# EAGLE design Single_RGB_Board (EAGLE 9.5.1)
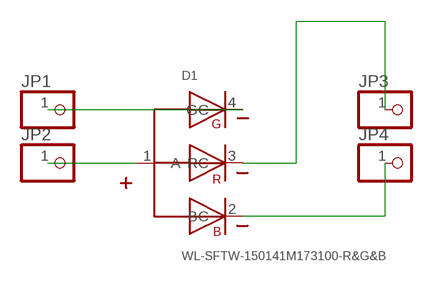
[diagram p0: schematic, sheet 1]

## Parts
D1  WL-SFTW-150141M173100-R&G&B  [3528-COMMON-ANODE]
JP1  PINHD-1X1  [1X01]
JP2  PINHD-1X1  [1X01]
JP3  PINHD-1X1  [1X01]
JP4  PINHD-1X1  [1X01]

## Nets
N$1: D1.4(GC) JP1.1
N$2: D1.1(A) JP2.1
N$3: D1.3(RC) JP3.1
N$4: D1.2(BC) JP4.1

## Library data of the parts
D1 = Wurth_Elektronik_Optoelectronics_rev15b:WL-SFTW: SMD full-color TOP LED Characteristics Low energy consumption High reliability Low current requirement Fast switching No UV/IR radiation High brightness RGB individual control Compact package outline Black surface Applications Flash light Switch indicators Equipments indicators Accent and decorative lighting Electronic signage Video displays Backlight for LCDs, PDAs and TVs Oven, microwave Street lighting Ideal for lateral coupling in light guides <http://katalog.we-online.de/media/images/eipal/WL-SFTW_pf2.jpg> Details see: http://katalog.we-online.de/en/led/WL-SFTW?m Updated 2015-04-10 2015 (C) Wurth Elektronik
JP1-JP4 = pinhead:PINHD-1X1: PIN HEADER

## Board
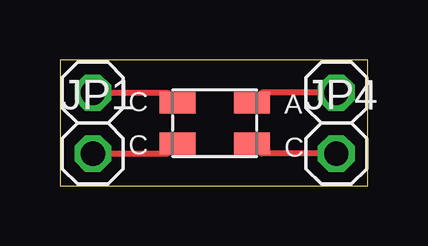
[diagram p1: board, top side]

Size 12.85 x 5.26 mm. Coordinates in mm from the lower left corner, seen from the top.
Outline: 0,0 12.85,0 12.85,5.26 0,5.26 0,0
Copper layers (1*16): Top 0.035mm / dielectric 1.5mm / Bottom 0.035mm
Design rules "default": minimum track width 6mil, minimum drill 0.35mm, track to track 6mil, track to pad 6mil, pad to pad 6mil, via to via 6mil, smd to smd 6mil, copper to edge 40mil, drill to drill 6mil, minimum pad ring 10mil, minimum via ring 8mil, stop-mask expansion 4mil, vias tented up to drill 0mil, thermal gap 10mil

### Footprints (pad centres in the part's own frame; a part is rotated, then mirrored left to right if it is on the bottom)
3528-COMMON-ANODE = smd 1.5 x 0.9: 1 1.55,0.85; 2 1.55,-0.85; 3 -1.55,0.85; 4 -1.55,-0.85
1X01 = drill 1.016 octagon: 1 0,0

### Placement (x,y rotation side)
D1  6.45,2.62 0 top
JP1  1.37,1.35 0 top
JP2  11.53,3.89 0 top
JP3  1.37,3.89 0 top
JP4  11.53,1.35 0 top

### Tracks (layer width: path | path; a pad name or v marks a point on that pad's centre or on a via)
N$1
  Top 0.254: JP1.1 4.48,1.35 D1.4
N$2
  Top 0.254: D1.1 8.42,3.89 JP2.1
N$3
  Top 0.254: JP3.1 4.48,3.89 D1.3
N$4
  Top 0.254: JP4.1 8.42,1.35 D1.2